# EAGLE design bot (EAGLE 9.3.2)
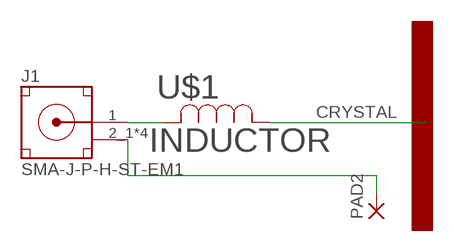
[diagram p0: schematic, sheet 1]

## Parts
J1  SMA-J-P-H-ST-EM1  [SMA-J-P-H-ST-EM1]
PAD2  2,54/1,1  [2,54/1,1]
U$1  INDUCTOR  [IND_7030]

## Nets
2L: J1.1(SIGNAL) U$1.2
CRYSTAL: U$1.1
GND: J1.2_1(GND) J1.2_2(GND) J1.3_1(GND) J1.3_2(GND) PAD2.1(P)

## Library data of the parts
J1 = SMA-J-P-H-ST-EM1:SMA-J-P-H-ST-EM1: Connector SMA F 50Ohm Solder ST Edge Mount Gold Over Nickel Tray; DESCRIPTION: Connector SMA F 50Ohm Solder ST Edge Mount Gold Over Nickel Tray; DIGI-KEY_PART_NUMBER: SAM8857-ND; DIGI-KEY_PURCHASE_URL: https://www.digikey.com/product-detail/en/samtec-inc/SMA-J-P-H-ST-EM1/SAM8857-ND/2602450?utm_source=snapeda&utm_medium=aggregator&utm_campaign=symbol; MF: Samtec; MP: SMA-J-P-H-ST-EM1; PACKAGE: None
PAD2 = wirepad:2,54/1,1: THROUGH-HOLE PAD
U$1 = new_inductor:INDUCTOR

## Module 1
Ports: 

### Library data of the parts

## Board
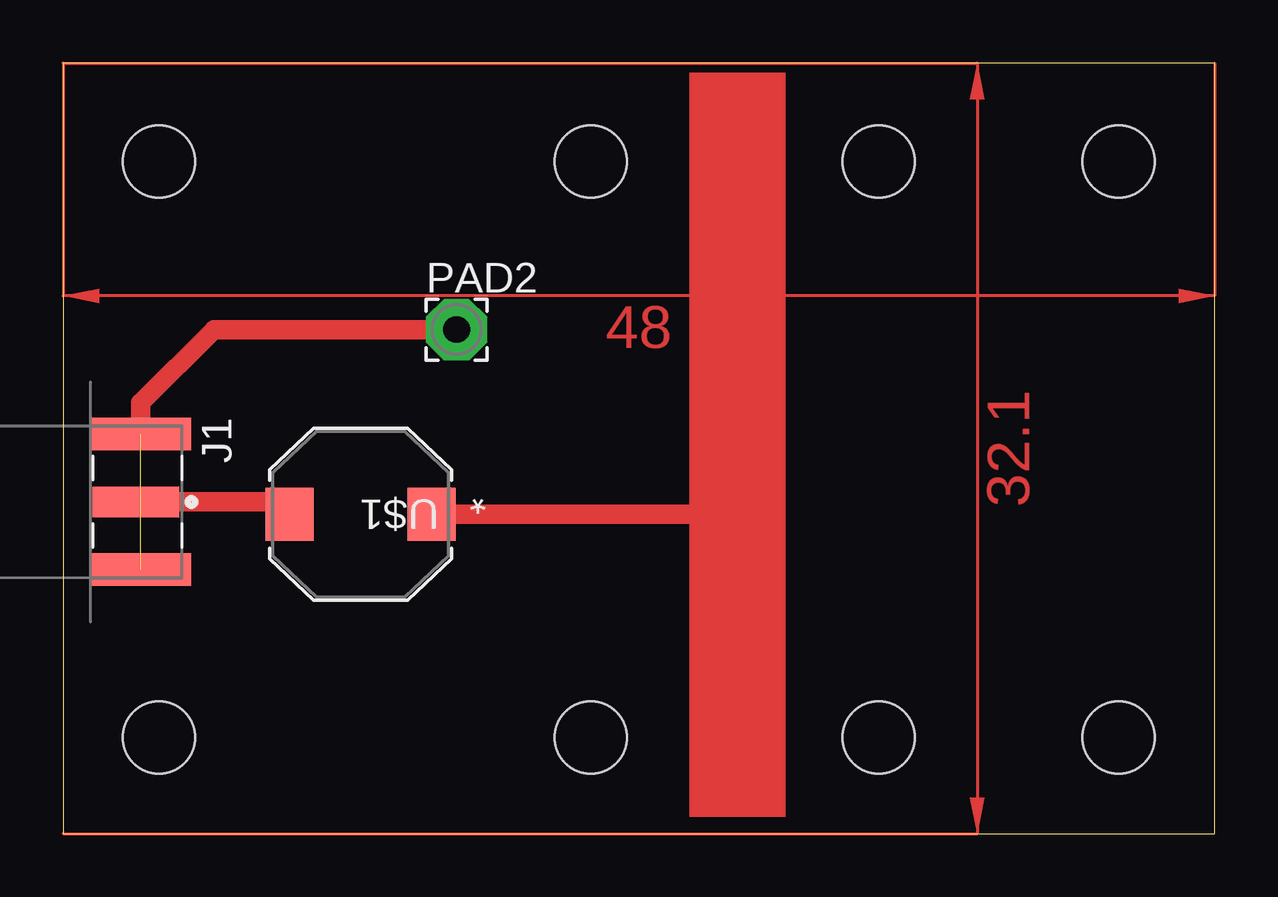
[diagram p1: board, top side]
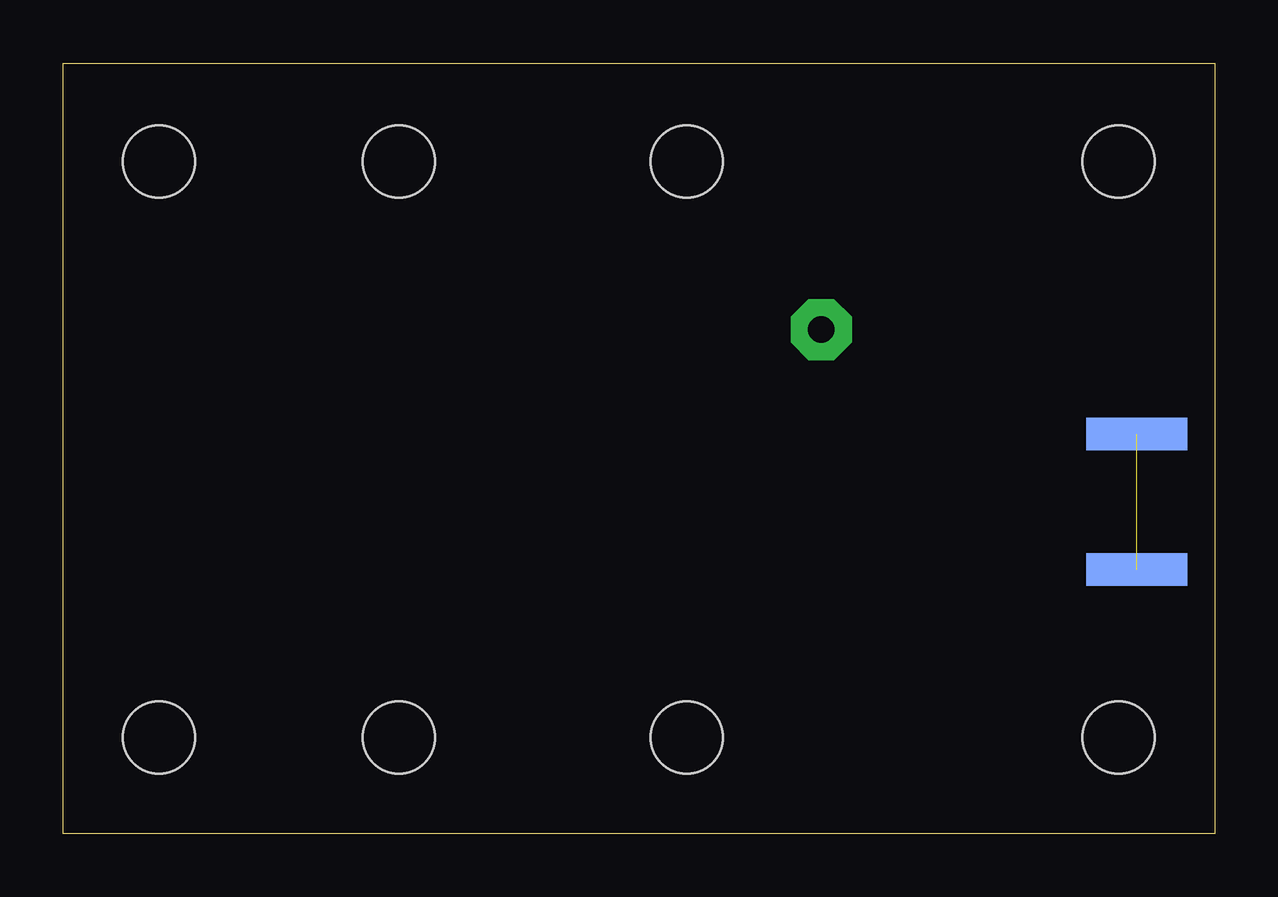
[diagram p2: board, bottom side, seen from below]

Size 48 x 32.1 mm. Coordinates in mm from the lower left corner, seen from the top.
Outline: 0,0 48,0 48,32.1 0,32.1 0,0
Copper layers (1*16): Top 0.035mm / dielectric 1.5mm / Bottom 0.035mm
Design rules "default": minimum track width 6mil, minimum drill 0.35mm, track to track 6mil, track to pad 6mil, pad to pad 6mil, via to via 6mil, smd to smd 6mil, copper to edge 40mil, drill to drill 6mil, minimum pad ring 10mil, minimum via ring 8mil, stop-mask expansion 4mil, vias tented up to drill 0mil, thermal gap 10mil
Holes 3 mm at 22,28 34,28 4,28 4,4 44,4 44,28 22,4 34,4

### Footprints (pad centres in the part's own frame; a part is rotated, then mirrored left to right if it is on the bottom)
SMA-J-P-H-ST-EM1 = smd 1.27 x 3.6: 1 0,0 | smd 1.35 x 4.2: 2_1 -2.825,0.2; 3_1 2.825,0.2 | smd 1.35 x 4.2 bottom: 2_2 -2.825,0.2; 3_2 2.825,0.2
2,54/1,1 = drill 1.118 pad 2.54 octagon: 1 0,0
IND_7030 = smd 2 x 2.2: 1 -2.95,0; 2 2.95,0

### Placement (x,y rotation side)
J1  3.04,13.82 270 top
PAD2  16.4,21 0 top
U$1  12.4,13.3 180 top

### Tracks (layer width: path | path; a pad name or v marks a point on that pad's centre or on a via)
2L
  Top 0.813: U$1.2 8.93,13.82 J1.1
CRYSTAL
  Top 0.813: U$1.1 26.93,13.3
GND  (3 unrouted)
  Top 0.813: J1.2_1 3.24,17.94 6.3,21 7.7,21 PAD2.1
(copper drawn outside any net)
  shapes: Top area x3